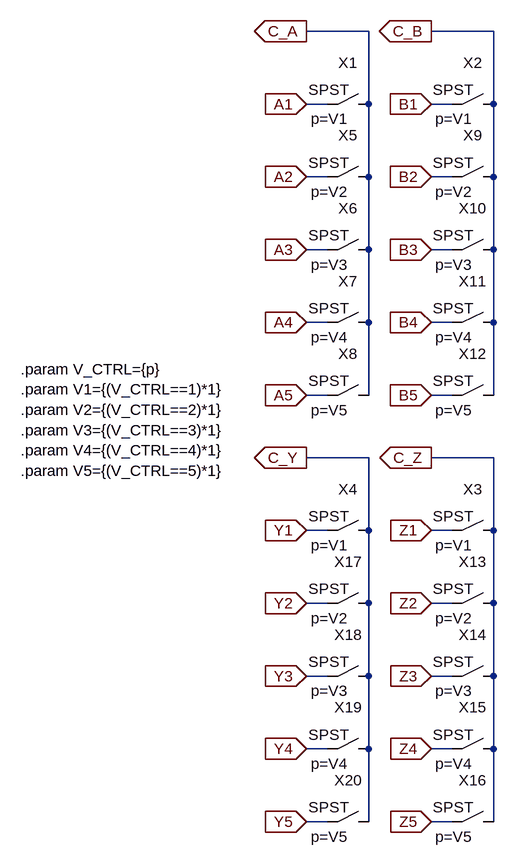
[diagram p0: schematic 5_way_SuperSwitch.asc]
5_way_SuperSwitch.asc, the LTspice schematic file:
Version 4
SHEET 1 1164 1432
WIRE 448 96 352 96
WIRE 640 96 544 96
WIRE 384 208 352 208
WIRE 448 208 448 96
WIRE 576 208 544 208
WIRE 640 208 640 96
WIRE 384 320 352 320
WIRE 448 320 448 208
WIRE 576 320 544 320
WIRE 640 320 640 208
WIRE 384 432 352 432
WIRE 448 432 448 320
WIRE 576 432 544 432
WIRE 640 432 640 320
WIRE 384 544 352 544
WIRE 448 544 448 432
WIRE 576 544 544 544
WIRE 640 544 640 432
WIRE 384 656 352 656
WIRE 448 656 448 544
WIRE 576 656 544 656
WIRE 640 656 640 544
WIRE 448 752 352 752
WIRE 640 752 544 752
WIRE 384 864 352 864
WIRE 448 864 448 752
WIRE 576 864 544 864
WIRE 640 864 640 752
WIRE 384 976 352 976
WIRE 448 976 448 864
WIRE 576 976 544 976
WIRE 640 976 640 864
WIRE 384 1088 352 1088
WIRE 448 1088 448 976
WIRE 576 1088 544 1088
WIRE 640 1088 640 976
WIRE 384 1200 352 1200
WIRE 448 1200 448 1088
WIRE 576 1200 544 1200
WIRE 640 1200 640 1088
WIRE 384 1312 352 1312
WIRE 448 1312 448 1200
WIRE 576 1312 544 1312
WIRE 640 1312 640 1200
FLAG 352 208 A1
IOPIN 352 208 In
FLAG 352 320 A2
IOPIN 352 320 In
FLAG 352 432 A3
IOPIN 352 432 In
FLAG 352 544 A4
IOPIN 352 544 In
FLAG 352 656 A5
IOPIN 352 656 In
FLAG 352 96 C_A
IOPIN 352 96 Out
FLAG 352 864 Y1
IOPIN 352 864 In
FLAG 352 976 Y2
IOPIN 352 976 In
FLAG 352 1088 Y3
IOPIN 352 1088 In
FLAG 352 1200 Y4
IOPIN 352 1200 In
FLAG 352 1312 Y5
IOPIN 352 1312 In
FLAG 352 752 C_Y
IOPIN 352 752 Out
FLAG 544 208 B1
IOPIN 544 208 In
FLAG 544 320 B2
IOPIN 544 320 In
FLAG 544 432 B3
IOPIN 544 432 In
FLAG 544 544 B4
IOPIN 544 544 In
FLAG 544 656 B5
IOPIN 544 656 In
FLAG 544 96 C_B
IOPIN 544 96 Out
FLAG 544 864 Z1
IOPIN 544 864 In
FLAG 544 976 Z2
IOPIN 544 976 In
FLAG 544 1088 Z3
IOPIN 544 1088 In
FLAG 544 1200 Z4
IOPIN 544 1200 In
FLAG 544 1312 Z5
IOPIN 544 1312 In
FLAG 544 752 C_Z
IOPIN 544 752 Out
SYMBOL SPST 416 208 R0
WINDOW 39 -29 23 Center 2
SYMATTR InstName X1
SYMATTR SpiceLine p=V1
SYMBOL SPST 608 208 R0
WINDOW 39 -29 23 Center 2
SYMATTR InstName X2
SYMATTR SpiceLine p=V1
SYMBOL SPST 608 864 R0
WINDOW 39 -29 23 Center 2
SYMATTR InstName X3
SYMATTR SpiceLine p=V1
SYMBOL SPST 416 864 R0
WINDOW 39 -29 23 Center 2
SYMATTR InstName X4
SYMATTR SpiceLine p=V1
SYMBOL SPST 416 320 R0
WINDOW 39 -29 23 Center 2
SYMATTR InstName X5
SYMATTR SpiceLine p=V2
SYMBOL SPST 416 432 R0
WINDOW 39 -29 23 Center 2
SYMATTR InstName X6
SYMATTR SpiceLine p=V3
SYMBOL SPST 416 544 R0
WINDOW 39 -29 23 Center 2
SYMATTR InstName X7
SYMATTR SpiceLine p=V4
SYMBOL SPST 416 656 R0
WINDOW 39 -29 23 Center 2
SYMATTR InstName X8
SYMATTR SpiceLine p=V5
SYMBOL SPST 608 320 R0
WINDOW 39 -29 23 Center 2
SYMATTR InstName X9
SYMATTR SpiceLine p=V2
SYMBOL SPST 608 432 R0
WINDOW 39 -29 23 Center 2
SYMATTR InstName X10
SYMATTR SpiceLine p=V3
SYMBOL SPST 608 544 R0
WINDOW 39 -29 23 Center 2
SYMATTR InstName X11
SYMATTR SpiceLine p=V4
SYMBOL SPST 608 656 R0
WINDOW 39 -29 23 Center 2
SYMATTR InstName X12
SYMATTR SpiceLine p=V5
SYMBOL SPST 608 976 R0
WINDOW 39 -29 23 Center 2
SYMATTR InstName X13
SYMATTR SpiceLine p=V2
SYMBOL SPST 608 1088 R0
WINDOW 39 -29 23 Center 2
SYMATTR InstName X14
SYMATTR SpiceLine p=V3
SYMBOL SPST 608 1200 R0
WINDOW 39 -29 23 Center 2
SYMATTR InstName X15
SYMATTR SpiceLine p=V4
SYMBOL SPST 608 1312 R0
WINDOW 39 -29 23 Center 2
SYMATTR InstName X16
SYMATTR SpiceLine p=V5
SYMBOL SPST 416 976 R0
WINDOW 39 -29 23 Center 2
SYMATTR InstName X17
SYMATTR SpiceLine p=V2
SYMBOL SPST 416 1088 R0
WINDOW 39 -29 23 Center 2
SYMATTR InstName X18
SYMATTR SpiceLine p=V3
SYMBOL SPST 416 1200 R0
WINDOW 39 -29 23 Center 2
SYMATTR InstName X19
SYMATTR SpiceLine p=V4
SYMBOL SPST 416 1312 R0
WINDOW 39 -29 23 Center 2
SYMATTR InstName X20
SYMATTR SpiceLine p=V5
TEXT -88 616 Left 2 !.param V_CTRL={p}\n.param V1={(V_CTRL==1)*1}\n.param V2={(V_CTRL==2)*1}\n.param V3={(V_CTRL==3)*1}\n.param V4={(V_CTRL==4)*1}\n.param V5={(V_CTRL==5)*1}

The netlist it stands for:
* 5_way_SuperSwitch.asc
XX1 A1 C_A SPST p=V1  ; pins In Out
XX2 B1 C_B SPST p=V1  ; pins In Out
XX3 Z1 C_Z SPST p=V1  ; pins In Out
XX4 Y1 C_Y SPST p=V1  ; pins In Out
XX5 A2 C_A SPST p=V2  ; pins In Out
XX6 A3 C_A SPST p=V3  ; pins In Out
XX7 A4 C_A SPST p=V4  ; pins In Out
XX8 A5 C_A SPST p=V5  ; pins In Out
XX9 B2 C_B SPST p=V2  ; pins In Out
XX10 B3 C_B SPST p=V3  ; pins In Out
XX11 B4 C_B SPST p=V4  ; pins In Out
XX12 B5 C_B SPST p=V5  ; pins In Out
XX13 Z2 C_Z SPST p=V2  ; pins In Out
XX14 Z3 C_Z SPST p=V3  ; pins In Out
XX15 Z4 C_Z SPST p=V4  ; pins In Out
XX16 Z5 C_Z SPST p=V5  ; pins In Out
XX17 Y2 C_Y SPST p=V2  ; pins In Out
XX18 Y3 C_Y SPST p=V3  ; pins In Out
XX19 Y4 C_Y SPST p=V4  ; pins In Out
XX20 Y5 C_Y SPST p=V5  ; pins In Out
.param V_CTRL={p}
.param V1={(V_CTRL==1)*1}
.param V2={(V_CTRL==2)*1}
.param V3={(V_CTRL==3)*1}
.param V4={(V_CTRL==4)*1}
.param V5={(V_CTRL==5)*1}
.backanno
.end